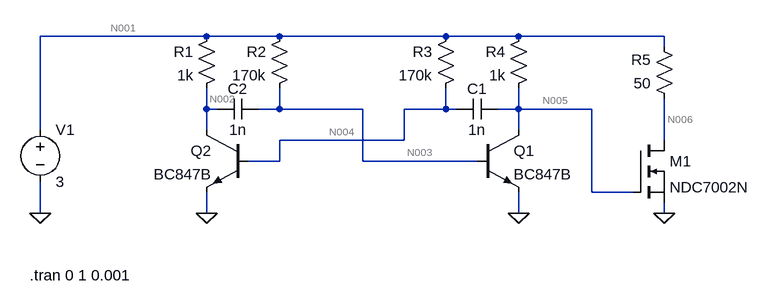
[diagram p0: schematic oscillator.asc]
oscillator.asc, the LTspice schematic file:
Version 4
SHEET 1 880 680
WIRE -240 64 -496 64
WIRE -128 64 -240 64
WIRE 128 64 -128 64
WIRE 240 64 128 64
WIRE 464 64 240 64
WIRE 464 80 464 64
WIRE -240 176 -240 144
WIRE -224 176 -240 176
WIRE -128 176 -128 144
WIRE -128 176 -160 176
WIRE 0 176 -128 176
WIRE 128 176 128 144
WIRE 128 176 64 176
WIRE 144 176 128 176
WIRE 240 176 240 144
WIRE 240 176 208 176
WIRE 352 176 240 176
WIRE -496 208 -496 64
WIRE -240 208 -240 176
WIRE 240 208 240 176
WIRE 64 224 64 176
WIRE 64 224 -128 224
WIRE 464 224 464 160
WIRE -128 256 -128 224
WIRE -128 256 -176 256
WIRE 0 256 0 176
WIRE 176 256 0 256
WIRE 352 304 352 176
WIRE 416 304 352 304
WIRE -496 336 -496 288
WIRE -240 336 -240 304
WIRE 240 336 240 304
WIRE 464 336 464 320
FLAG 240 336 0
FLAG -240 336 0
FLAG -496 336 0
FLAG 464 336 0
SYMBOL npn 176 208 R0
SYMATTR InstName Q1
SYMATTR Value BC847B
SYMBOL npn -176 208 M0
SYMATTR InstName Q2
SYMATTR Value BC847B
SYMBOL Res -224 48 M0
SYMATTR InstName R1
SYMATTR Value 1k
SYMBOL Res -112 48 M0
SYMATTR InstName R2
SYMATTR Value 170k
SYMBOL Res 144 48 M0
SYMATTR InstName R3
SYMATTR Value 170k
SYMBOL Res 256 48 M0
SYMATTR InstName R4
SYMATTR Value 1k
SYMBOL Cap 208 160 R90
WINDOW 0 0 32 VBottom 2
WINDOW 3 32 32 VTop 2
SYMATTR InstName C1
SYMATTR Value 1n
SYMBOL Cap -160 160 R90
WINDOW 0 0 32 VBottom 2
WINDOW 3 32 32 VTop 2
SYMATTR InstName C2
SYMATTR Value 1n
SYMBOL Voltage -496 192 R0
SYMATTR InstName V1
SYMATTR Value 3
SYMBOL Res 480 176 R180
WINDOW 0 36 76 Left 2
WINDOW 3 36 40 Left 2
SYMATTR InstName R5
SYMATTR Value 50
SYMBOL nmos 416 224 R0
SYMATTR InstName M1
SYMATTR Value NDC7002N
TEXT -512 432 Left 2 !.tran 0 1 0.001

The netlist it stands for:
* oscillator.asc
Q1 N005 N003 0 0 BC847B
Q2 N002 N004 0 0 BC847B
R1 N001 N002 1k
R2 N001 N003 170k
R3 N001 N004 170k
R4 N001 N005 1k
C1 N005 N004 1n
C2 N003 N002 1n
V1 N001 0 3
R5 N006 N001 50
M1 N006 N005 0 0 NDC7002N
.model NPN NPN
.model PNP PNP
.lib standard.bjt
.model NMOS NMOS
.model PMOS PMOS
.lib standard.mos
.tran 0 1 0.001
.backanno
.end

* Results of the author's LTspice run, read from the files saved beside the schematic
* Operating Point, zero values left out:
*   V(n005) = 139.6 mV
*   V(n003) = 633.3 mV
*   V(n002) = 139.6 mV
*   V(n004) = 633.3 mV
*   V(n001) = 3 V
*   V(n006) = 3 V
*   Ic(Q1) = 2.86 mA
*   Ib(Q1) = 13.92 µA
*   Ie(Q1) = -2.874 mA
*   Ic(Q2) = 2.86 mA
*   Ib(Q2) = 13.92 µA
*   Ie(Q2) = -2.874 mA
*   Id(M1) = 5 pA
*   Is(M1) = -5 pA
*   I(R1) = 2.86 mA
*   I(R2) = 13.92 µA
*   I(R3) = 13.92 µA
*   I(R4) = 2.86 mA
*   I(R5) = -8 pA
*   I(V1) = -5.749 mA